# Altium schematic sheet channel_ctrl.SchDoc
size A3; SheetNumber: 2; SheetTotal: 4
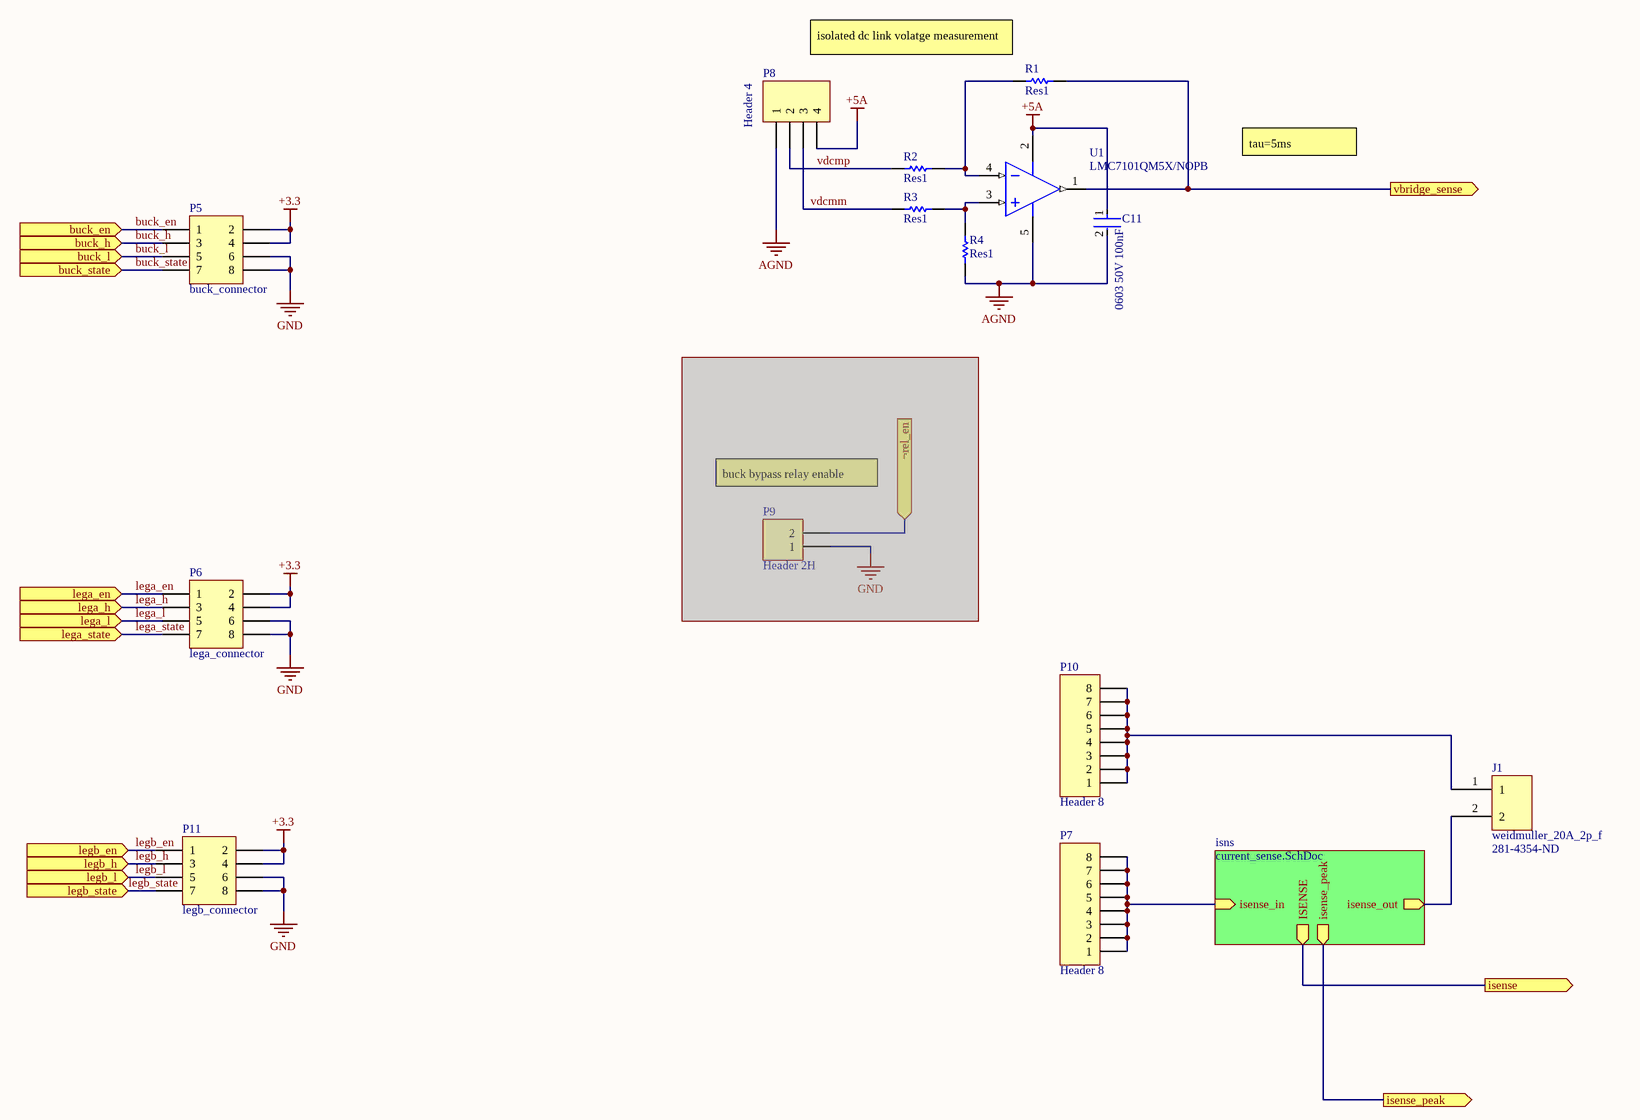
[diagram p0: channel_ctrl.SchDoc]

## Parts
C11  0603 50V 100nF  [FP-CGA3E-0_3-0_1-IPC_A]
J1  weidmuller_20A_2p_f  Supplier Part Number 1: 281-4354-ND  [weidmuller_19A_2p_m]
P5  buck_connector  [header_4_2_f]
P6  lega_connector  [header_4_2_f]
P7  Header 8  [header_4_2_f]
P8  Header 4  [header_2_2_f]
P9  Header 2H  [HEADER_1_2_f]  (masked out: inside a compile mask, not in the netlist)
P10  Header 8  [header_4_2_f]
P11  legb_connector  [header_4_2_f]
R1  Res1  [RES 0805_2012]
R2  Res1  [RES 0603_1608]
R3  Res1  [RES 0603_1608]
R4  Res1  [RES 0805_2012]
U1  LMC7101QM5X/NOPB  [DBV0005A_M]

## Sub-sheets
isns = current_sense.SchDoc: isense_in (in), isense_out (out), ISENSE (out), isense_peak (out)

## Ports
buck_en (in), buck_h (in), buck_l (in), buck_state (in), isense (out), isense_peak (out), lega_en (in), lega_h (in), lega_l (in), lega_state (in), legb_en (in), legb_h (in), legb_l (in), legb_state (in), vbridge_sense (out), ¬rel_en (in)

## Nets
+3.3: P5.2 P5.4 P6.2 P6.4 P11.2 P11.4
+5A: C11.1 P8.4 U1.2(V+)
AGND: C11.2 P8.1 R4.1 U1.5(V-)
GND: P5.6 P5.8 P6.6 P6.8 P11.6 P11.8
buck_en: P5.1 ; port buck_en
buck_h: P5.3 ; port buck_h
buck_l: P5.5 ; port buck_l
buck_state: P5.7 ; port buck_state
isense: port isense, sheet isns/ISENSE
isense_peak: port isense_peak, sheet isns/isense_peak
lega_en: P6.1 ; port lega_en
lega_h: P6.3 ; port lega_h
lega_l: P6.5 ; port lega_l
lega_state: P6.7 ; port lega_state
legb_en: P11.1 ; port legb_en
legb_h: P11.3 ; port legb_h
legb_l: P11.5 ; port legb_l
legb_state: P11.7 ; port legb_state
vbridge_sense: R1.2 U1.1(OUT) ; port vbridge_sense
vdcmm: P8.3 R3.1
vdcmp: P8.2 R2.1
NetJ1_1: J1.1 P10.1 P10.2 P10.3 P10.4 P10.5 P10.6 P10.7 P10.8
NetJ1_2: J1.2 ; sheet isns/isense_out
NetP7_1: P7.1 P7.2 P7.3 P7.4 P7.5 P7.6 P7.7 P7.8 ; sheet isns/isense_in
NetR1_1: R1.1 R2.2 U1.4(IN-)
NetR3_2: R3.2 R4.2 U1.3(IN+)

## Notes on the sheet
- (near R1) isolated dc link volatge measurement
- tau=5ms
- (near P9) buck bypass relay enable
- 1
- 2
- 3
- 4
- 5
- 6
- 7
- 8
- A
- B
- C
- D
- Project:
- Date:
- Drawing number:
- Rev:
- Format:
- A3
- Drawn by:
- Laboratory:
- Page
- Sheet:
- of
- File:

## Library data of the parts
C11 = CMP-2000-07546-2: Cap Ceramic 100nF 50V X7R 10% Pad SMD 0603 +125°C Automotive T/R / CGA3E2X7R1H104K080AA; Weight: 7.1E-05oz; Composition: Ceramic; Max Operating Temperature: 125°C; Termination: SMD/SMT; Dielectric: X7R; Length: 1.6mm; Package Quantity: 1; REACH SVHC: No SVHC; Lead Free: Lead Free; Case Code (Metric): 1608; Min Operating Temperature: -55°C; Packaging: Tape and Reel; Tolerance: 10%; Voltage Rating: 50V; Case Code (Imperial): 0603; Capacitance: 100nF; Case/Package: 0603; Voltage Rating (DC): 50V; Depth: 0.8mm; Radiation Hardening: No; Ratings: AEC-Q200; Mount: Surface Mount; Voltage: 50V; Thickness: 0.035inch; Width: 0.8mm; Height: 0.8mm
J1 = weidmuller_20A_2p_f: Connector Block 19A Male Receptor; Supplier 1: Digi-Key
P5 P6 P11 = Header 4X2: Header, 4-Pin, Dual row; LatestRevisionDate: 17-Jul-2002; LatestRevisionNote: Re-released for DXP Platform.; Publisher: Altium Limited; System: Connector
P7 P10 = Header 8: Header, 8-Pin; LatestRevisionDate: 17-Jul-2002; LatestRevisionNote: Re-released for DXP Platform.; Publisher: Altium Limited
P8 = Header 4: Header, 4-Pin; LatestRevisionDate: 17-Jul-2002; LatestRevisionNote: Re-released for DXP Platform.; Publisher: Altium Limited
P9 = Header 2H: Header, 2-Pin, Right Angle; LatestRevisionDate: 17-Jul-2002; LatestRevisionNote: Re-released for DXP Platform.; Publisher: Altium Limited
R1-R4 = Res1: Resistor; Value: 1K; Published: 8-Jun-2000; LatestRevisionDate: 17-Jul-2002; LatestRevisionNote: Re-released for DXP Platform.; PackageReference: AXIAL-0.3; Publisher: Altium Limited; PackageDescription: Axial Device, Thru-Hole; 2 Leads; 0.3 in Pin Spacing
U1 = CMP-0055-01329-3: Tiny Low power Operational Amplifier with Rail-to-Rail Input and Output, 5-pin SOT-23, Pb-Free; Manufacturer: Texas Instruments; CompType: Amplifiers; PackageTopMarking: AT6A*XTT; PowerWise: N; RoHS: Y; ComponentLink1URL: http://www.ti.com/general/docs/lit/getliterature.tsp?genericPartNumber=LMC7101Q-Q1&fileType=pdf; ComponentLink1Description: Datasheet URL; Package Reference: DBV0005A; PackageDescription: Molded SOT-23, .115 x .063 x .040 in Body, 5 Lead, .0375 in Pitch; PinCount: 5